# Altium schematic sheet RS422.SchDoc
size 420 x 297 mm; SheetNumber: 21; SheetTotal: 23
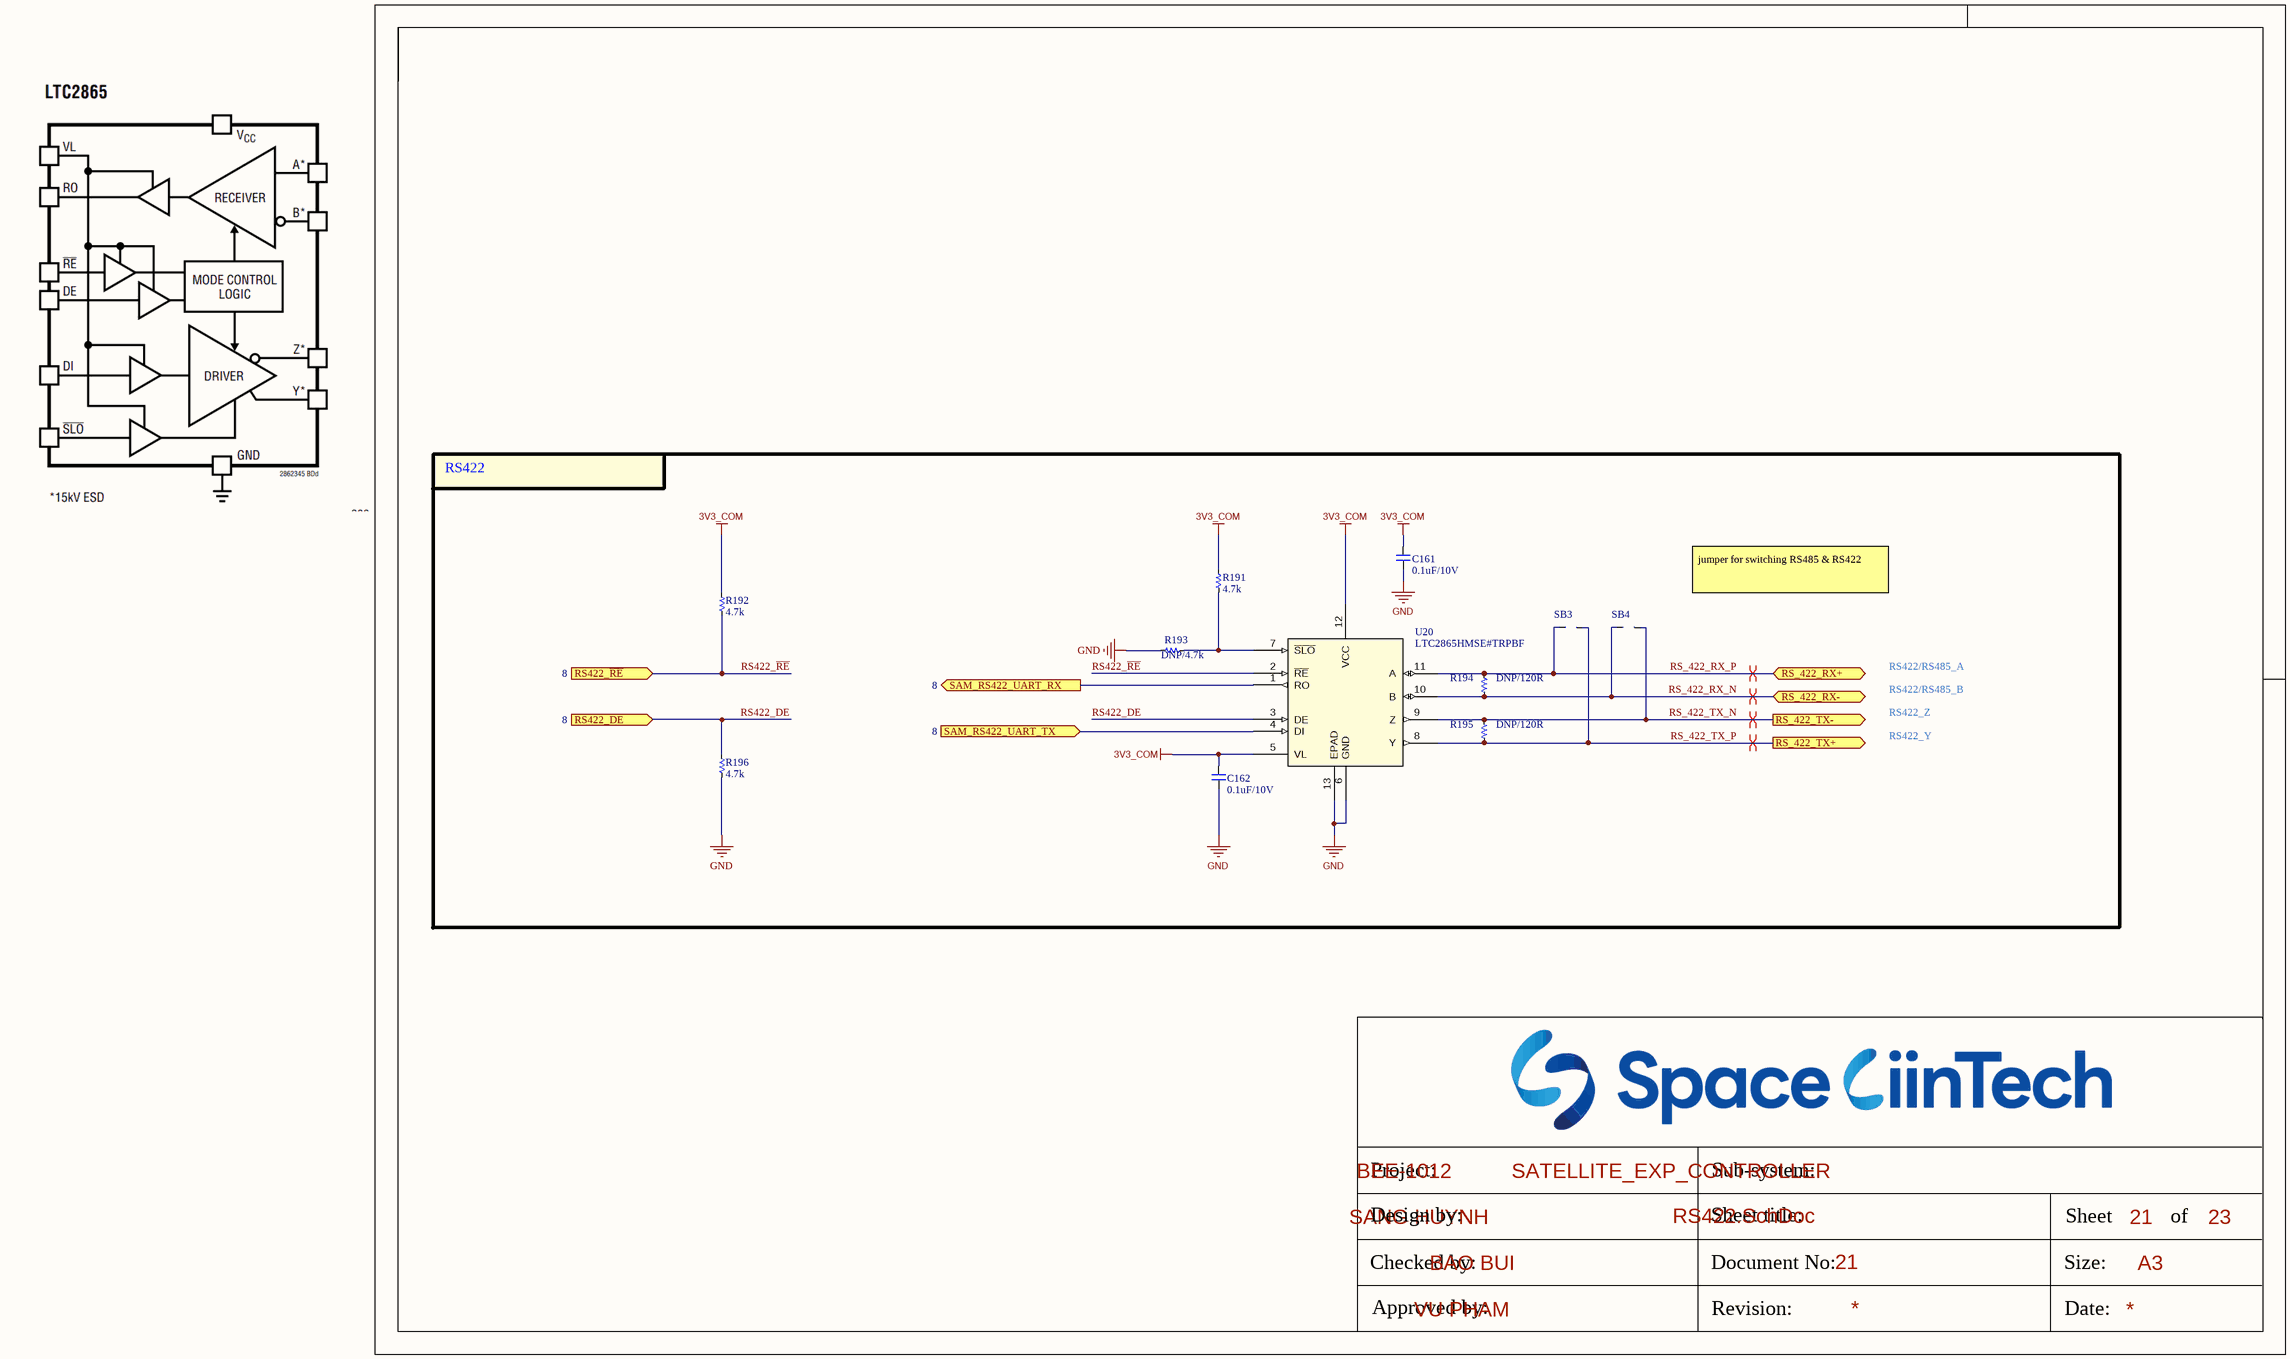
[diagram p0: RS422.SchDoc]

## Parts
C161  0.1uF/10V  [CAP_C_1005X50_L]
C162  0.1uF/10V  [CAP_C_1005X50_L]
R191  4.7k  [RES_C_1005x30_L]
R192  4.7k  [RES_C_1005x30_L]
R193  DNP/4.7k  [RES_C_1005x30_L]
R194  DNP/120R  [RES_C_1005x30_L]
R195  DNP/120R  [RES_C_1005x30_L]
R196  4.7k  [RES_C_1005x30_L]
SB3  JUMPER  [JUMPER_1608]  (value not drawn)
SB4  JUMPER  [JUMPER_1608]  (value not drawn)
U20  LTC2865HMSE#TRPBF  [MSOP-12_MSE_LIT]

## Ports
RS422_DE (in, see 8), RS422_~{RE} (in, see 8), RS_422_RX+ (bidir, see 5), RS_422_RX- (bidir, see 5), RS_422_TX+ (out, see 5), RS_422_TX- (out, see 5), SAM_RS422_UART_RX (out, see 8), SAM_RS422_UART_TX (in, see 8)

## Nets
3V3_COM: C161.2 C162.2 R191.2 R192.2 U20.5(VL) U20.12(VCC)
GND: C161.1 C162.1 R193.2 R196.1 U20.6(GND) U20.13(EPAD)
RS422_DE: R196.2 U20.3(DE) ; port RS422_DE
RS422_~{RE}: R192.1 U20.2(~{RE}) ; port RS422_~{RE}
RS_422_RX_N: R194.2 SB4.1 U20.10(B) ; port RS_422_RX-
RS_422_RX_P: R194.1 SB3.1 U20.11(A) ; port RS_422_RX+
RS_422_TX_N: R195.1 SB4.2 U20.9(Z) ; port RS_422_TX-
RS_422_TX_P: R195.2 SB3.2 U20.8(Y) ; port RS_422_TX+
SAM_RS422_UART_RX: U20.1(RO) ; port SAM_RS422_UART_RX
SAM_RS422_UART_TX: U20.4(DI) ; port SAM_RS422_UART_TX
NetR191_1: R191.1 R193.1 U20.7(~{SLO})

## Layout directives
differential pair: RS_422_RX_N, RS_422_RX_P, RS_422_TX_N, RS_422_TX_P

## Notes on the sheet
- RS422
- jumper for switching RS485 & RS422
- RS422/RS485_A
- RS422/RS485_B
- RS422_Z
- RS422_Y
- Project:
- BEE-1012
- Sub-system:
- SATELLITE_EXP_CONTROLLER
- Design by:
- SANG HUYNH
- BAO BUI
- Sheet title:
- Sheet
- A3
- of
- Checked by:
- Approved by:
- VU PHAM
- Revision:
- Document No:
- Size:
- Date:

## Library data of the parts
C161 C162 = _CAP_C_2: CAP CHIP
R191-R196 = _RES_B_2: RES
U20 = LTC2865HMSETRPBF: Â±60V Fault Protected 3V to 5.5V RS485/RS422 Transceivers; Manufacturer_Name: Analog Devices Inc; Copyright: Copyright (C) 2025 Ultra Librarian. All rights reserved.; Manufacturer_Part_Number: LTC2865HMSE#TRPBF; RefDes: RefDes; Type: Type